# Altium schematic sheet LC BigOne - 5.3A MOSFET for TLC5940 2.SchDoc: DBL TLC5940 driver for High load - 5.3A MOSFET
size A4; Revision: 0; SheetNumber: 2; SheetTotal: 2; Version: 1.0; Variant: 5.3 A MOSFET; Modification: Mod; Project: Light Control
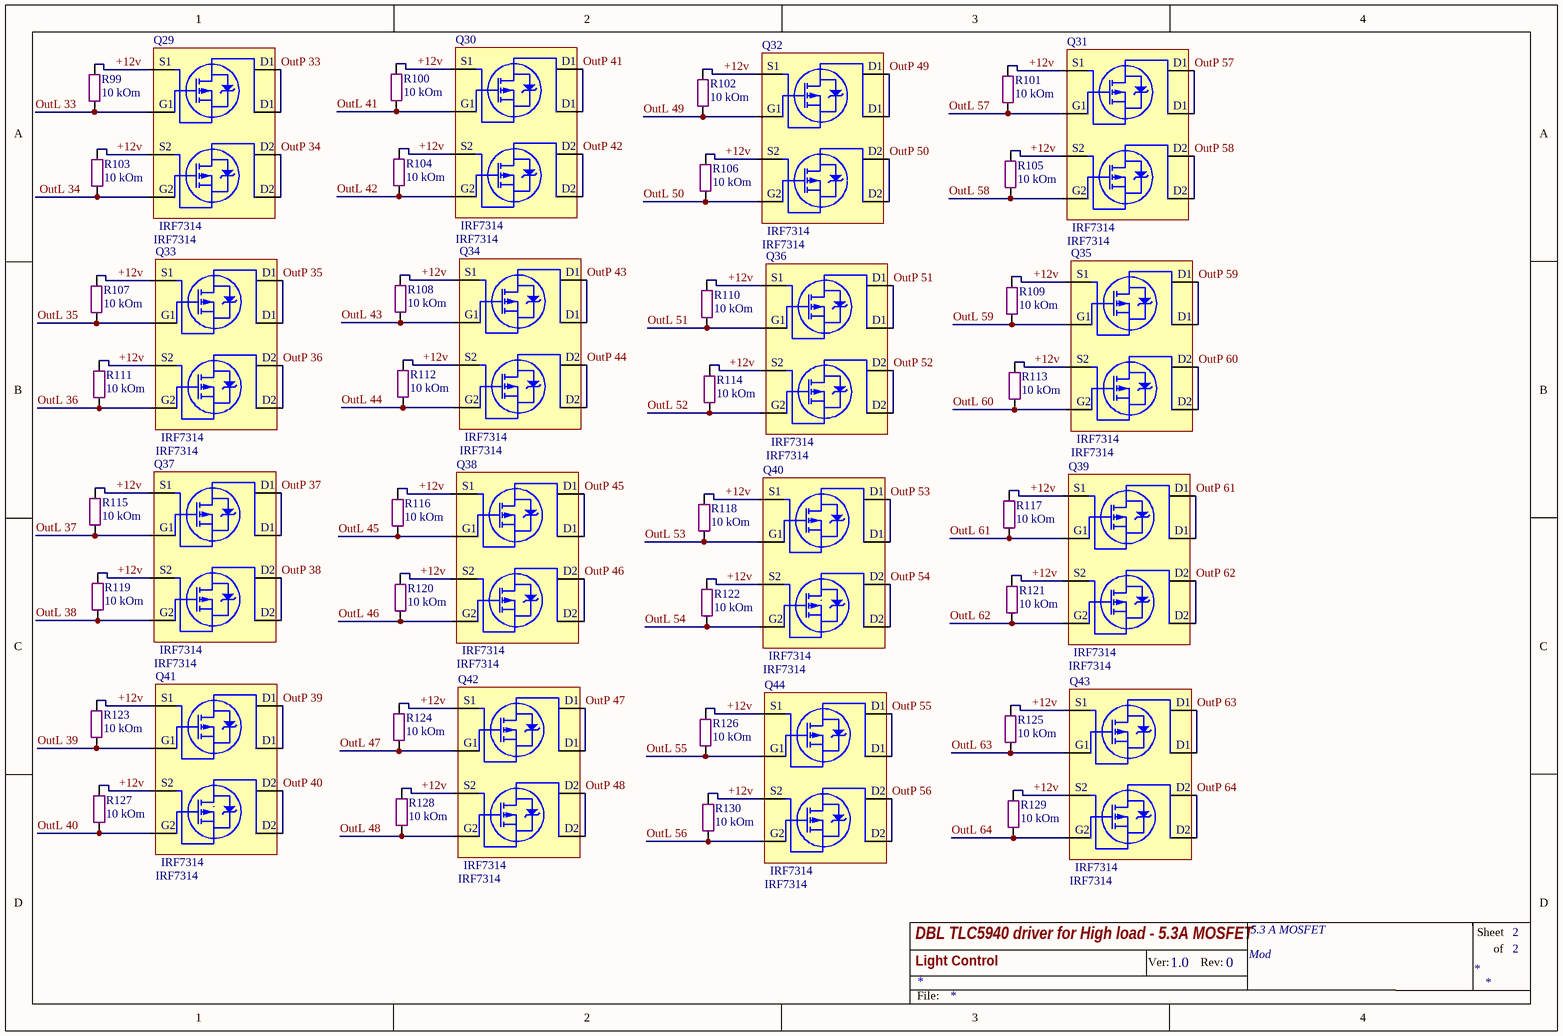
[diagram p0: LC BigOne - 5.3A MOSFET for TLC5940 2.SchDoc]

## Parts
Q29  IRF7314  [SO8]
Q30  IRF7314  [SO8]
Q31  IRF7314  [SO8]
Q32  IRF7314  [SO8]
Q33  IRF7314  [SO8]
Q34  IRF7314  [SO8]
Q35  IRF7314  [SO8]
Q36  IRF7314  [SO8]
Q37  IRF7314  [SO8]
Q38  IRF7314  [SO8]
Q39  IRF7314  [SO8]
Q40  IRF7314  [SO8]
Q41  IRF7314  [SO8]
Q42  IRF7314  [SO8]
Q43  IRF7314  [SO8]
Q44  IRF7314  [SO8]
R99  10 kOm  [SMD 0805 (2012)]
R100  10 kOm  [SMD 0805 (2012)]
R101  10 kOm  [SMD 0805 (2012)]
R102  10 kOm  [SMD 0805 (2012)]
R103  10 kOm  [SMD 0805 (2012)]
R104  10 kOm  [SMD 0805 (2012)]
R105  10 kOm  [SMD 0805 (2012)]
R106  10 kOm  [SMD 0805 (2012)]
R107  10 kOm  [SMD 0805 (2012)]
R108  10 kOm  [SMD 0805 (2012)]
R109  10 kOm  [SMD 0805 (2012)]
R110  10 kOm  [SMD 0805 (2012)]
R111  10 kOm  [SMD 0805 (2012)]
R112  10 kOm  [SMD 0805 (2012)]
R113  10 kOm  [SMD 0805 (2012)]
R114  10 kOm  [SMD 0805 (2012)]
R115  10 kOm  [SMD 0805 (2012)]
R116  10 kOm  [SMD 0805 (2012)]
R117  10 kOm  [SMD 0805 (2012)]
R118  10 kOm  [SMD 0805 (2012)]
R119  10 kOm  [SMD 0805 (2012)]
R120  10 kOm  [SMD 0805 (2012)]
R121  10 kOm  [SMD 0805 (2012)]
R122  10 kOm  [SMD 0805 (2012)]
R123  10 kOm  [SMD 0805 (2012)]
R124  10 kOm  [SMD 0805 (2012)]
R125  10 kOm  [SMD 0805 (2012)]
R126  10 kOm  [SMD 0805 (2012)]
R127  10 kOm  [SMD 0805 (2012)]
R128  10 kOm  [SMD 0805 (2012)]
R129  10 kOm  [SMD 0805 (2012)]
R130  10 kOm  [SMD 0805 (2012)]

## Nets
+12v: Q29.1(S) Q29.3(S) Q30.1(S) Q30.3(S) Q31.1(S) Q31.3(S) Q32.1(S) Q32.3(S) Q33.1(S) Q33.3(S) Q34.1(S) Q34.3(S) Q35.1(S) Q35.3(S) Q36.1(S) Q36.3(S) Q37.1(S) Q37.3(S) Q38.1(S) Q38.3(S) Q39.1(S) Q39.3(S) Q40.1(S) Q40.3(S) Q41.1(S) Q41.3(S) Q42.1(S) Q42.3(S) Q43.1(S) Q43.3(S) Q44.1(S) Q44.3(S) R99.2 R100.2 R101.2 R102.2 R103.2 R104.2 R105.2 R106.2 R107.2 R108.2 R109.2 R110.2 R111.2 R112.2 R113.2 R114.2 R115.2 R116.2 R117.2 R118.2 R119.2 R120.2 R121.2 R122.2 R123.2 R124.2 R125.2 R126.2 R127.2 R128.2 R129.2 R130.2
OutL 33: Q29.2(G) R99.1
OutL 34: Q29.4(G) R103.1
OutL 35: Q33.2(G) R107.1
OutL 36: Q33.4(G) R111.1
OutL 37: Q37.2(G) R115.1
OutL 38: Q37.4(G) R119.1
OutL 39: Q41.2(G) R123.1
OutL 40: Q41.4(G) R127.1
OutL 41: Q30.2(G) R100.1
OutL 42: Q30.4(G) R104.1
OutL 43: Q34.2(G) R108.1
OutL 44: Q34.4(G) R112.1
OutL 45: Q38.2(G) R116.1
OutL 46: Q38.4(G) R120.1
OutL 47: Q42.2(G) R124.1
OutL 48: Q42.4(G) R128.1
OutL 49: Q32.2(G) R102.1
OutL 50: Q32.4(G) R106.1
OutL 51: Q36.2(G) R110.1
OutL 52: Q36.4(G) R114.1
OutL 53: Q40.2(G) R118.1
OutL 54: Q40.4(G) R122.1
OutL 55: Q44.2(G) R126.1
OutL 56: Q44.4(G) R130.1
OutL 57: Q31.2(G) R101.1
OutL 58: Q31.4(G) R105.1
OutL 59: Q35.2(G) R109.1
OutL 60: Q35.4(G) R113.1
OutL 61: Q39.2(G) R117.1
OutL 62: Q39.4(G) R121.1
OutL 63: Q43.2(G) R125.1
OutL 64: Q43.4(G) R129.1
OutP 33: Q29.7(D) Q29.8(D)
OutP 34: Q29.5(D) Q29.6(D)
OutP 35: Q33.7(D) Q33.8(D)
OutP 36: Q33.5(D) Q33.6(D)
OutP 37: Q37.7(D) Q37.8(D)
OutP 38: Q37.5(D) Q37.6(D)
OutP 39: Q41.7(D) Q41.8(D)
OutP 40: Q41.5(D) Q41.6(D)
OutP 41: Q30.7(D) Q30.8(D)
OutP 42: Q30.5(D) Q30.6(D)
OutP 43: Q34.7(D) Q34.8(D)
OutP 44: Q34.5(D) Q34.6(D)
OutP 45: Q38.7(D) Q38.8(D)
OutP 46: Q38.5(D) Q38.6(D)
OutP 47: Q42.7(D) Q42.8(D)
OutP 48: Q42.5(D) Q42.6(D)
OutP 49: Q32.7(D) Q32.8(D)
OutP 50: Q32.5(D) Q32.6(D)
OutP 51: Q36.7(D) Q36.8(D)
OutP 52: Q36.5(D) Q36.6(D)
OutP 53: Q40.7(D) Q40.8(D)
OutP 54: Q40.5(D) Q40.6(D)
OutP 55: Q44.7(D) Q44.8(D)
OutP 56: Q44.5(D) Q44.6(D)
OutP 57: Q31.7(D) Q31.8(D)
OutP 58: Q31.5(D) Q31.6(D)
OutP 59: Q35.7(D) Q35.8(D)
OutP 60: Q35.5(D) Q35.6(D)
OutP 61: Q39.7(D) Q39.8(D)
OutP 62: Q39.5(D) Q39.6(D)
OutP 63: Q43.7(D) Q43.8(D)
OutP 64: Q43.5(D) Q43.6(D)

## Notes on the sheet
- Ver:
- Rev:
- Sheet
- of
- File:
- (in symbol IRF7314) S1; D1; G1; S2; D2; G2

## Library data of the parts
Q29-Q44 = IRF7314: Dual P-Ch  20V - 0.058Ω - 5.3A; Monufacturer: IOR; RDS Сопротивление Сток-Исток: 0.058 Om; I d - Drain current (continuous) at TC = 100°C: 4.3 A; VGS Порог Открытия: -0.7 V; VGS Макс напр на гейте: +-12 V; C ISS Входная емкость: 780 pF; C OSS Выходная емкость: 470 pF; V DSS (v): 20V; I d - Drain current (continuous) at TC = 25°C: 5.3 A; Name: IRF7314; Datasheet: http://tec.org.ru/_bd/2/277_IRF7314-IR.pdf; URL: http://tec.org.ru/board/49-1-0-277
R99-R130 = Res All Types